# EAGLE design v.2 (EAGLE 9.6.1)
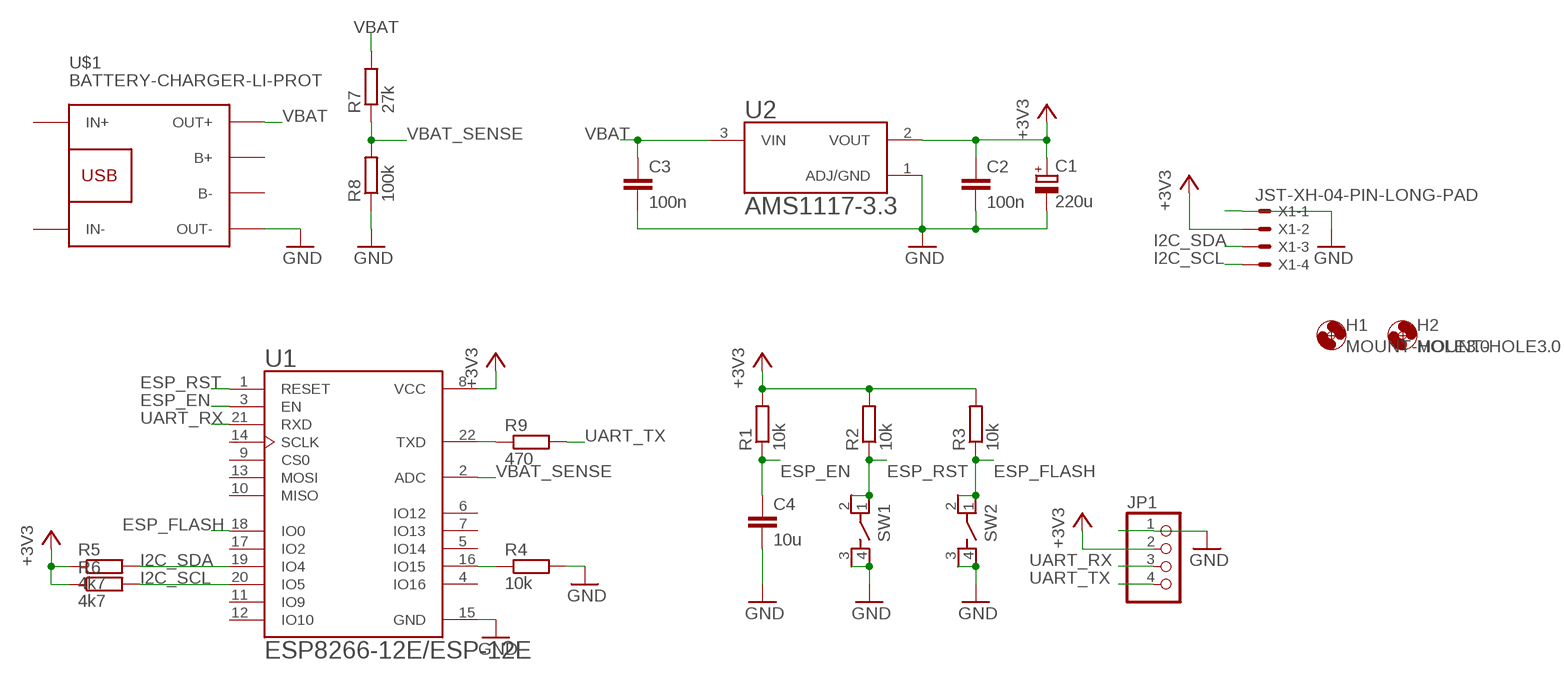
[diagram p0: schematic, sheet 1]

## Parts
C1  220u  CPOL-EU153CLV-0605  [153CLV-0605]
C2  100n  C-EUC0805  [C0805]
C3  100n  C-EUC0805  [C0805]
C4  10u  C-EUC0805  [C0805]
H1  MOUNT-HOLE3.0  [3,0]
H2  MOUNT-HOLE3.0  [3,0]
JP1  PINHD-1X4  [1X04]
R1  10k  R-EU_R0805  [R0805]
R2  10k  R-EU_R0805  [R0805]
R3  10k  R-EU_R0805  [R0805]
R4  10k  R-EU_R0805  [R0805]
R5  4k7  R-EU_R0805  [R0805]
R6  4k7  R-EU_R0805  [R0805]
R7  27k  R-EU_R0805  [R0805]
R8  100k  R-EU_R0805  [R0805]
R9  470  R-EU_R0805  [R0805]
SW1  PTS810_SJM_250_SMTR_LFS  [SW_PTS810_SJM_250_SMTR_LFS]
SW2  PTS810_SJM_250_SMTR_LFS  [SW_PTS810_SJM_250_SMTR_LFS]
U1  ESP8266-12E/ESP-12E  [XCVR_ESP8266-12E/ESP-12E]
U2  AMS1117-3.3  [SOT229P700X180-4N]
U$1  BATTERY-CHARGER-LI-PROT  [BATTERY-CHARGER-LI-PROT]
X1  JST-XH-04-PIN-LONG-PAD  [JST-XH-04-PACKAGE-LONG-PAD]

## Nets
+3V3: C1.+ C2.1 JP1.2 R1.2 R2.2 R3.2 R5.1 R6.1 U1.8(VCC) U2.2(VOUT) X1.2
ESP_EN: C4.1 R1.1 U1.3(EN)
ESP_FLASH: R3.1 SW2.1 SW2.2 U1.18(IO0)
ESP_RST: R2.1 SW1.1 SW1.2 U1.1(RESET)
GND: C1.- C2.2 C3.2 C4.2 JP1.1 R4.2 R8.1 SW1.3 SW1.4 SW2.3 SW2.4 U1.15(GND) U2.1(ADJ/GND) U$1.OUT- X1.1
I2C_SCL: R6.2 U1.20(IO5) X1.4
I2C_SDA: R5.2 U1.19(IO4) X1.3
N$1: R9.1 U1.22(TXD)
N$2: R4.1 U1.16(IO15)
UART_RX: JP1.3 U1.21(RXD)
UART_TX: JP1.4 R9.2
VBAT: C3.1 R7.2 U2.3(VIN) U$1.OUT+
VBAT_SENSE: R7.1 R8.2 U1.2(ADC)
Unconnected: U1.4(IO16) U1.5(IO14) U1.6(IO12) U1.7(IO13) U1.9(CS0) U1.10(MISO) U1.11(IO9) U1.12(IO10) U1.13(MOSI) U1.14(SCLK) U1.17(IO2) U$1.B+ U$1.B- U$1.IN+ U$1.IN-

## Library data of the parts
C1 = rcl:CPOL-EU: POLARIZED CAPACITOR, European symbol; SPICEPREFIX: C
C2-C4 = rcl:C-EU: CAPACITOR, European symbol; SPICEPREFIX: C
H1 H2 = holes:MOUNT-HOLE: MOUNTING HOLE with drill center marker
JP1 = pinhead:PINHD-1X4: PIN HEADER
R1-R9 = rcl:R-EU_: RESISTOR, European symbol; SPICEPREFIX: R
SW1 SW2 = PTS810_SJM_250_SMTR_LFS:PTS810_SJM_250_SMTR_LFS: Switch Tactile Spst-No 0.05a 16v Check prices <https://pricing.snapeda.com/parts/PTS810%20SJM%20250%20SMTR%20LFS/C%26K/view-part?ref=eda>; AVAILABILITY: In Stock; DESCRIPTION: Tactile Switch SPST-NO Top Actuated Surface Mount; MF: C&K; MP: PTS810 SJM 250 SMTR LFS; PACKAGE: None; PRICE: None; PURCHASE-URL: https://pricing.snapeda.com/search/part/PTS810 SJM 250 SMTR LFS/?ref=eda
U1 = ESP8266-12E_ESP-12E:ESP8266-12E/ESP-12E: ESP-12E WiFi Module Check prices <https://pricing.snapeda.com/parts/ESP8266-12E/ESP-12E/AI-Thinker/view-part?ref=eda>; AVAILABILITY: Not in stock; DESCRIPTION: This WiFi module has a 32-bit MCU micro and clock speeds supporting 80 MHz or 160 MHz. Supports the RTOS and integrated Wi-Fi MAC/BB/RF/PA/LNA, and has an on-board antenna.; MF: AI-Thinker; MP: ESP8266-12E/ESP-12E; PACKAGE: None; PRICE: None
U2 = AMS1117-3.3:AMS1117-3.3: Sot223/Pkg 1-Amp 3.3-Volt Low Drop Out Voltage Regulatator; AVAILABILITY: Unavailable; DESCRIPTION: Sot223/Pkg 1-Amp 3.3-Volt Low Drop Out Voltage Regulatator; MF: Advanced Monolithic Systems; MP: AMS1117-3.3; PACKAGE: SOT-89 ams; PRICE: None
U$1 = diy-modules:BATTERY-CHARGER-LI-PROT: Lithium Battery 5V Charger with protection circuit More details available here: http://www.instructables.com/id/DIY-Lithium-ion-Battery-Charger/step4/TP4056-based-lithium-ion-battery-charger-module/ Click here to find device on ebay.com <http://www.ebay.com/sch/tp4056+charger+usb+protection>
X1 = Rembrandt Electronics - JST XH Connectors v1-0:JST-XH-04-PIN: JST XH Connector 2 Pin Wire to board connector. Pitch: 2,54 mm, (0.100") Number of pins: 4 Created by Rembrandt Electronics www.rembrandtelectronics.com

## Board
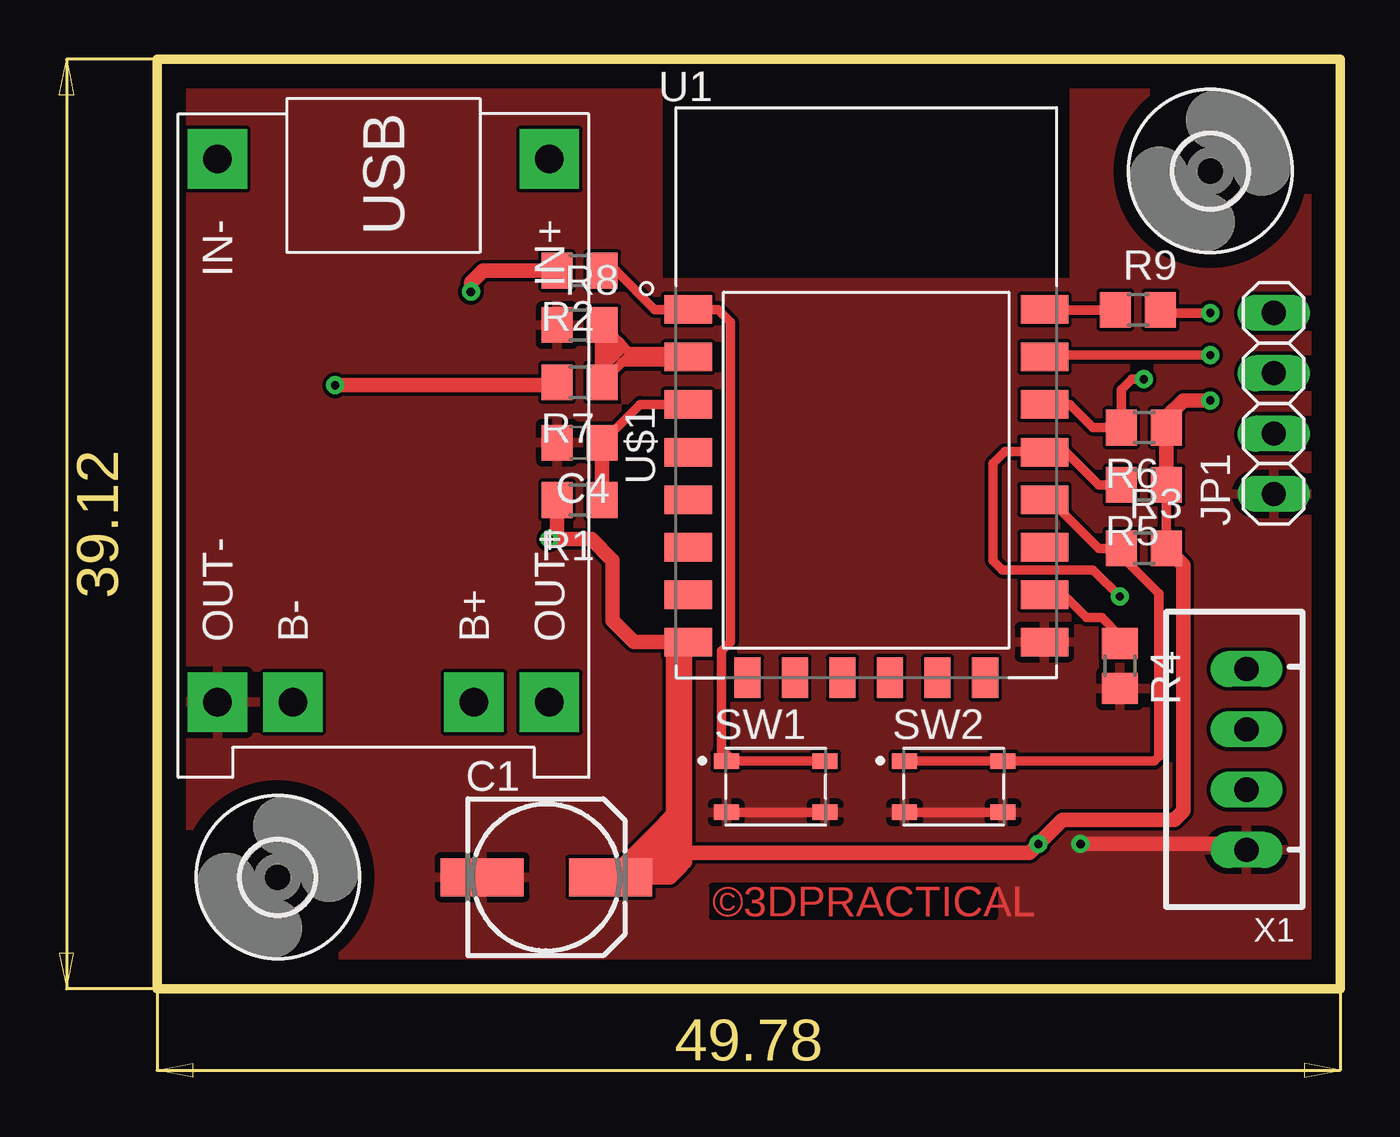
[diagram p1: board, top side]
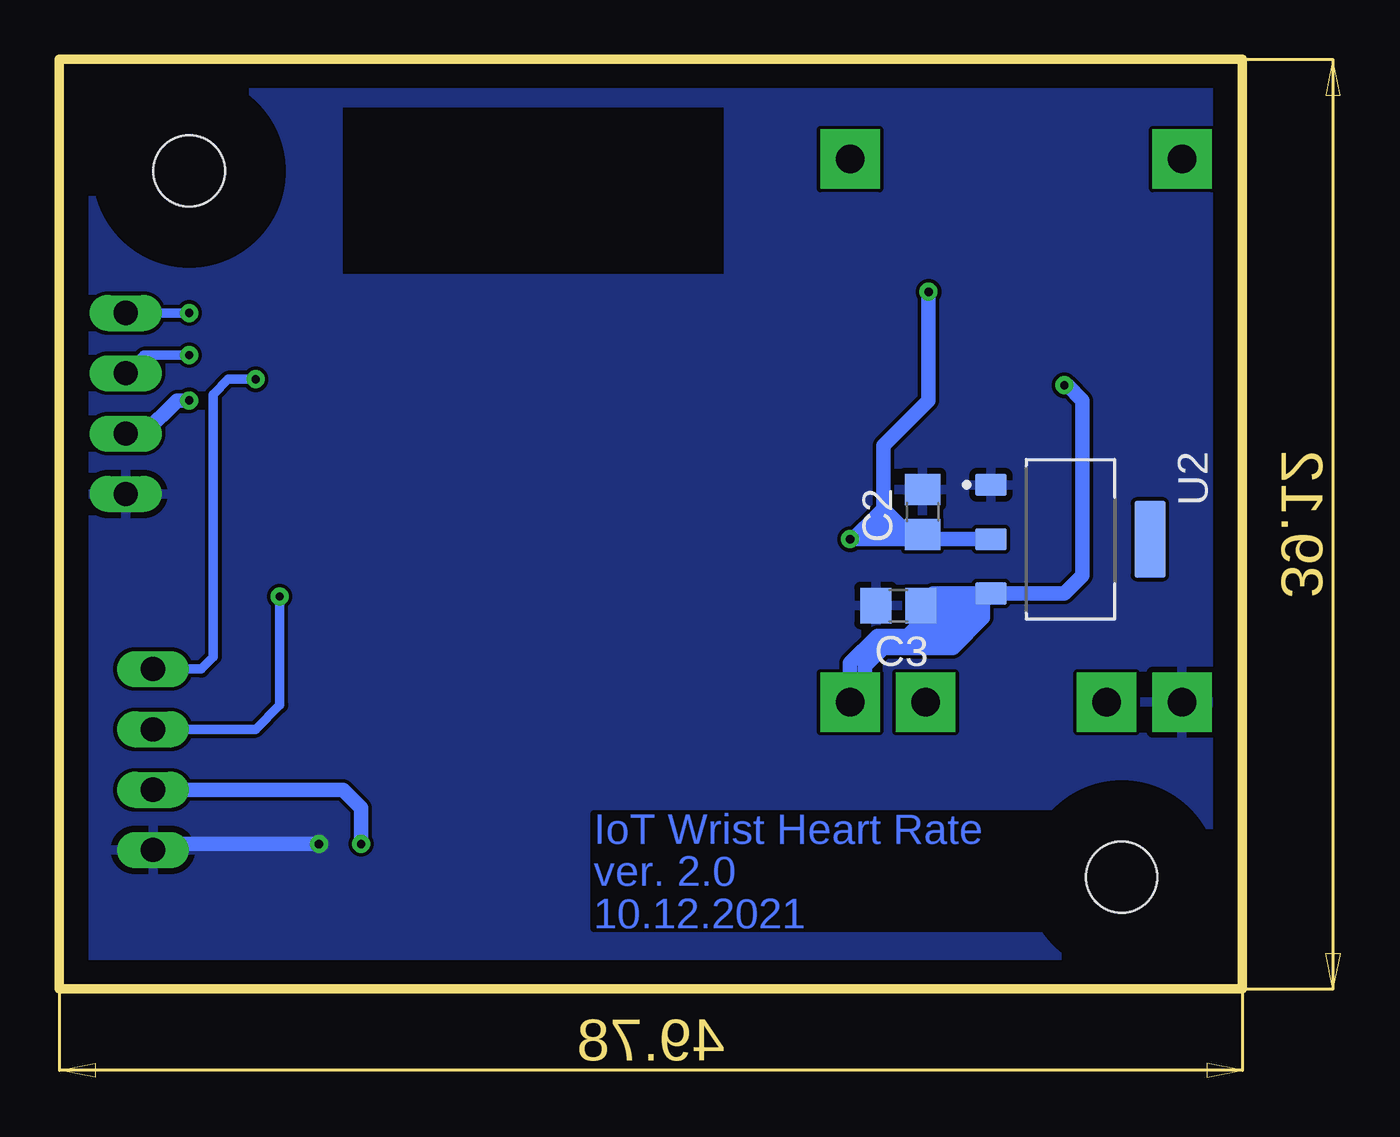
[diagram p2: board, bottom side, seen from below]

Size 49.78 x 39.12 mm. Coordinates in mm from the lower left corner, seen from the top.
Outline: 0,0 0,39.12 49.78,39.12 49.78,0 0,0
Copper layers (1*16): Top 0.035mm / dielectric 1.5mm / Bottom 0.035mm
Design rules "default": minimum track width 6mil, minimum drill 0.35mm, track to track 6mil, track to pad 6mil, pad to pad 6mil, via to via 6mil, smd to smd 6mil, copper to edge 40mil, drill to drill 6mil, minimum pad ring 10mil, minimum via ring 8mil, stop-mask expansion 4mil, vias tented up to drill 0mil, thermal gap 10mil

### Footprints (pad centres in the part's own frame; a part is rotated, then mirrored left to right if it is on the bottom)
153CLV-0605 = smd 3.5 x 1.6: + 2.7,0; - -2.7,0
C0805 = smd 1.3 x 1.5: 1 -0.95,0; 2 0.95,0
3,0 = hole 3: 0,0
1X04 = drill 1.016 long: 1 -3.81,0; 2 -1.27,0; 3 1.27,0; 4 3.81,0
R0805 = smd 1.3 x 1.5: 1 -0.95,0; 2 0.95,0
SW_PTS810_SJM_250_SMTR_LFS = smd 1.05 x 0.65: 1 -2.075,1.075; 2 2.075,1.075; 3 -2.075,-1.075; 4 2.075,-1.075
XCVR_ESP8266-12E/ESP-12E = smd 2 x 1.2: 1 -7.5,7; 2 -7.5,5; 3 -7.5,3; 4 -7.5,1; 5 -7.5,-1; 6 -7.5,-3; 7 -7.5,-5; 8 -7.5,-7; 15 7.5,-7; 16 7.5,-5; 17 7.5,-3; 18 7.5,-1; 19 7.5,1; 20 7.5,3; 21 7.5,5; 22 7.5,7 | smd 1.1 x 1.7: 9 -5,-8.5; 10 -3,-8.5; 11 -1,-8.5; 12 1,-8.5; 13 3,-8.5; 14 5,-8.5
SOT229P700X180-4N = smd 0.93 x 1.31: 1 -2.29,-3.345; 2 0,-3.345; 3 2.29,-3.345 | smd 3.24 x 1.31: 4 0,3.345
BATTERY-CHARGER-LI-PROT = drill 1.2 pad 2.5 square: B+ 10.795,3.81; B- 10.795,-3.81; IN+ -12.065,6.985; IN- -12.065,-6.985; OUT+ 10.795,6.985; OUT- 10.795,-6.985
JST-XH-04-PACKAGE-LONG-PAD = drill 1.016 long: 1 -3.81,0; 2 -1.27,0; 3 1.27,0; 4 3.81,0

### Placement (x,y rotation side)
C1  16.38,4.7 0 top
C2  13.46,20.07 90 bottom
C3  14.48,16.13 180 bottom
C4  17.78,22.99 180 top
H1  44.32,34.42 0 top
H2  5.08,4.7 0 top
JP1  46.99,24.64 90 top
R1  17.78,20.57 180 top
R2  17.78,30.23 180 top
R3  41.53,18.54 0 top
R4  40.51,13.59 270 top
R5  41.53,21.21 180 top
R6  41.53,23.62 180 top
R7  17.78,25.53 180 top
R8  17.78,27.94 0 top
R9  41.27,28.57 0 top
SW1  26.04,8.51 0 top
SW2  33.53,8.51 0 top
U1  29.84,21.59 0 top
U2  7.24,18.92 270 bottom
U$1  9.53,22.86 270 top
X1  45.85,9.65 90 top

### Tracks (layer width: path | path; a pad name or v marks a point on that pad's centre or on a via)
+3V3  (via drill 0.35)
  Top 0.406: R3.2 R5.1
  Top 0.61: R1.2 16.83,19.24 v16.51,18.92 18.29,18.92 19.18,18.03 19.18,15.49 20.08,14.59 21.72,14.59 | R2.2 13.72,30.23 13.21,29.72 v13.21,29.34 | R5.1 R6.1 42.48,24.06 43.18,24.77 v44.32,24.77 | 21.72,14.59 U1.8 22.23,14.47 22.23,5.33 22.04,5.14 | 21.72,14.59 21.72,7.33 | 20.57,4.7 C1.+ 20.97,6.59 | 20.57,4.7 20.95,4.7 | 20.95,4.7 21.59,4.7 22.04,5.14 | 21.72,7.33 21.72,6.48 | 21.72,6.48 21.72,5.71 | 21.72,5.71 21.72,5.46 | 21.72,5.46 22.04,5.14 | 21.72,5.46 21.4,5.14 | 21.4,5.14 20.95,4.7 | 20.97,6.59 21.72,7.33 | 21.4,5.14 21.4,5.65 21.08,5.97 | 21.08,5.97 21.46,5.97 21.72,5.71 | 20.97,6.59 21.61,6.59 | 21.72,6.48 21.61,6.59 | 21.61,6.59 20.95,5.94 20.95,4.7 | 21.08,5.97 20.57,5.46 20.57,4.7 | R3.2 43.18,17.84 43.18,7.49 42.8,7.11 38.1,7.11 v37.08,6.1 36.7,5.71 21.72,5.71
  Bottom 0.61: C2.1 13.27,18.92 U2.2 | C2.1 13.65,18.92 16.26,18.92 | 16.26,18.92 v16.51,18.92 15.88,18.92 15.24,19.56 | v13.21,29.34 13.21,24.77 15.11,22.86 15.11,20.19 | 15.11,20.19 14.04,19.12 | C2.1 14.04,19.12 | 14.04,19.12 14.8,19.12 15.24,19.56 | 15.49,19.81 16.26,19.05 16.26,18.92 | 15.24,19.56 15.49,19.81 | 15.49,19.81 15.11,20.19 | X1.2 37.85,8.38 37.08,7.62 v37.08,6.1 | JP1.2 46.23,23.37 44.83,24.77 v44.32,24.77
ESP_EN
  Top 0.406: C4.1 20.33,24.59 U1.3
  Top 0.61: R1.1 C4.1
ESP_FLASH
  Top 0.406: SW2.1 SW2.2 41.97,9.58 42.16,9.78 42.16,16.64 40.58,18.22 R3.1 39.62,18.54 37.58,20.59 U1.18
ESP_RST
  Top 0.406: 24.26,9.58 SW1.1 23.75,9.79 23.75,10.09 | 24.26,9.58 SW1.2 | R2.1 19.3,30.23 20.94,28.59 U1.1 23.61,28.59 24.13,28.07 24.13,14.61 23.75,14.22 23.75,10.09 | 23.75,10.09 24.26,9.58
GND  (via drill 0.35)
  Top 0.406: SW2.3 SW2.4 | SW1.3 SW1.4
  Top 0.61: X1.1 45.59,6.1 v38.86,6.1
  Bottom 0.61: v38.86,6.1 45.59,6.1 X1.1
  pour Top: 0,39.12 0,-0.13 0.13,-0.13 49.78,-0.13 49.78,38.99 38.61,38.99 38.61,29.97 38.61,29.72 21.08,29.72 21.08,29.84 21.08,39.12
  pour Bottom: 0,39.12 0,0 49.78,0 49.78,39.12 49.66,39.12
I2C_SCL  (via drill 0.35)
  Top 0.406: U1.20 38.4,24.59 39.37,23.62 R6.2 40.58,25.21 41.02,25.65 v41.53,25.65
  Bottom 0.406: v41.53,25.65 42.67,25.65 43.31,25.02 43.31,13.97 43.81,13.46 X1.4
I2C_SDA  (via drill 0.35)
  Top 0.406: U1.19 37.59,22.59 | 37.59,22.59 38.24,22.59 39.62,21.21 R5.2 | 37.59,22.59 37.58,22.61 35.69,22.61 35.18,22.1 35.18,18.03 35.58,17.63 39.39,17.63 v40.51,16.51
  Bottom 0.406: X1.3 41.53,10.92 40.51,11.94 v40.51,16.51
N$1
  Top 0.406: R9.1 37.36,28.57 U1.22
N$2
  Top 0.406: U1.16 38.15,16.59 39.12,15.62 39.75,15.62 40.51,14.86 R4.1
UART_RX  (via drill 0.35)
  Top 0.406: U1.21 37.42,26.67 v44.32,26.67
  Bottom 0.406: v44.32,26.67 46.23,26.67 JP1.3
UART_TX  (via drill 0.35)
  Top 0.406: v44.32,28.45 42.35,28.45 R9.2
  Bottom 0.406: JP1.4 v44.32,28.45
VBAT  (via drill 0.35)
  Top 0.61: v7.49,25.4 16.7,25.4 R7.2
  Bottom 0.61: 13.53,15.43 14.1,14.86 15.37,14.86 16.51,13.72 U$1.OUT+ 15.88,12.7 15.88,13.59 15.11,14.35 14.35,14.35 | 13.53,15.43 C3.1 13.02,16.63 12.7,16.63 | 12.7,16.63 12.06,16.63 | 12.06,16.63 11.56,16.63 | 11.56,16.63 U2.3 | 10.92,16.3 U2.3 | 12.7,14.35 12.19,14.35 10.92,15.62 10.92,16.13 | 12.7,14.35 13.08,14.35 | 13.08,14.35 13.72,14.35 | 13.72,14.35 14.35,14.35 | 13.53,15.43 12.7,16.26 12.7,16.63 | 13.72,14.35 12.06,16 12.06,16.26 | 12.06,16.26 12.06,16.63 | 14.35,14.35 12.45,16.26 12.06,16.26 | 12.7,14.35 11.56,15.49 | 11.56,15.49 11.56,15.88 | 11.56,15.88 11.56,16.63 | 13.08,14.35 11.56,15.88 | 11.56,15.88 11.14,16.3 10.92,16.3 | 11.56,15.49 10.92,16.13 | 10.92,16.13 10.92,16.3 | v7.49,25.4 7.37,25.4 6.73,24.77 6.73,17.4 7.5,16.63 U2.3
VBAT_SENSE
  Top 0.406: 19.59,26.39 R7.1 18.73,26.1 19.11,26.48 | 21.84,26.59 U1.2 19.79,26.59 19.59,26.39 | 19.65,27.02 19.84,26.83 21.61,26.83 21.84,26.59 | 19.65,27.02 19.4,27.27 | 19.4,27.27 19.27,27.4 | 19.27,27.4 R8.2 | 19.11,26.48 19.3,26.67 | 19.3,26.67 19.65,27.02 | 19.11,26.48 19.11,27.24 19.27,27.4 | 19.3,26.67 19.3,27.18 19.4,27.27 | 19.59,26.39 21.64,26.39 21.84,26.59
  Top 0.61: R7.1 R8.2

### Text on the board
Top: ©3DPRACTICAL
Bottom: IoT Wrist Heart Rate / ver. 2.0 / 10.12.2021